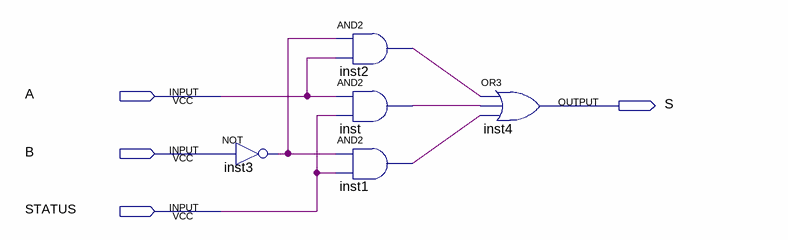
[diagram p0: schematic sheet]
// Quartus schematic module_bigger_than.bdf as structural Verilog: 5 symbols, 4 pins
module module_bigger_than (
  input  A,
  input  B,
  input  STATUS,
  output S
);

  wire inst1_out, inst2_out, inst3_out, inst_out;

  not inst3 (inst3_out, B);
  and inst2 (inst2_out, inst3_out, A);
  and inst (inst_out, A, STATUS);
  and inst1 (inst1_out, inst3_out, STATUS);
  or inst4 (S, inst2_out, inst_out, inst1_out);
endmodule
